# EAGLE design Y-babies ATtiny84 v04 (EAGLE 6.5.0)
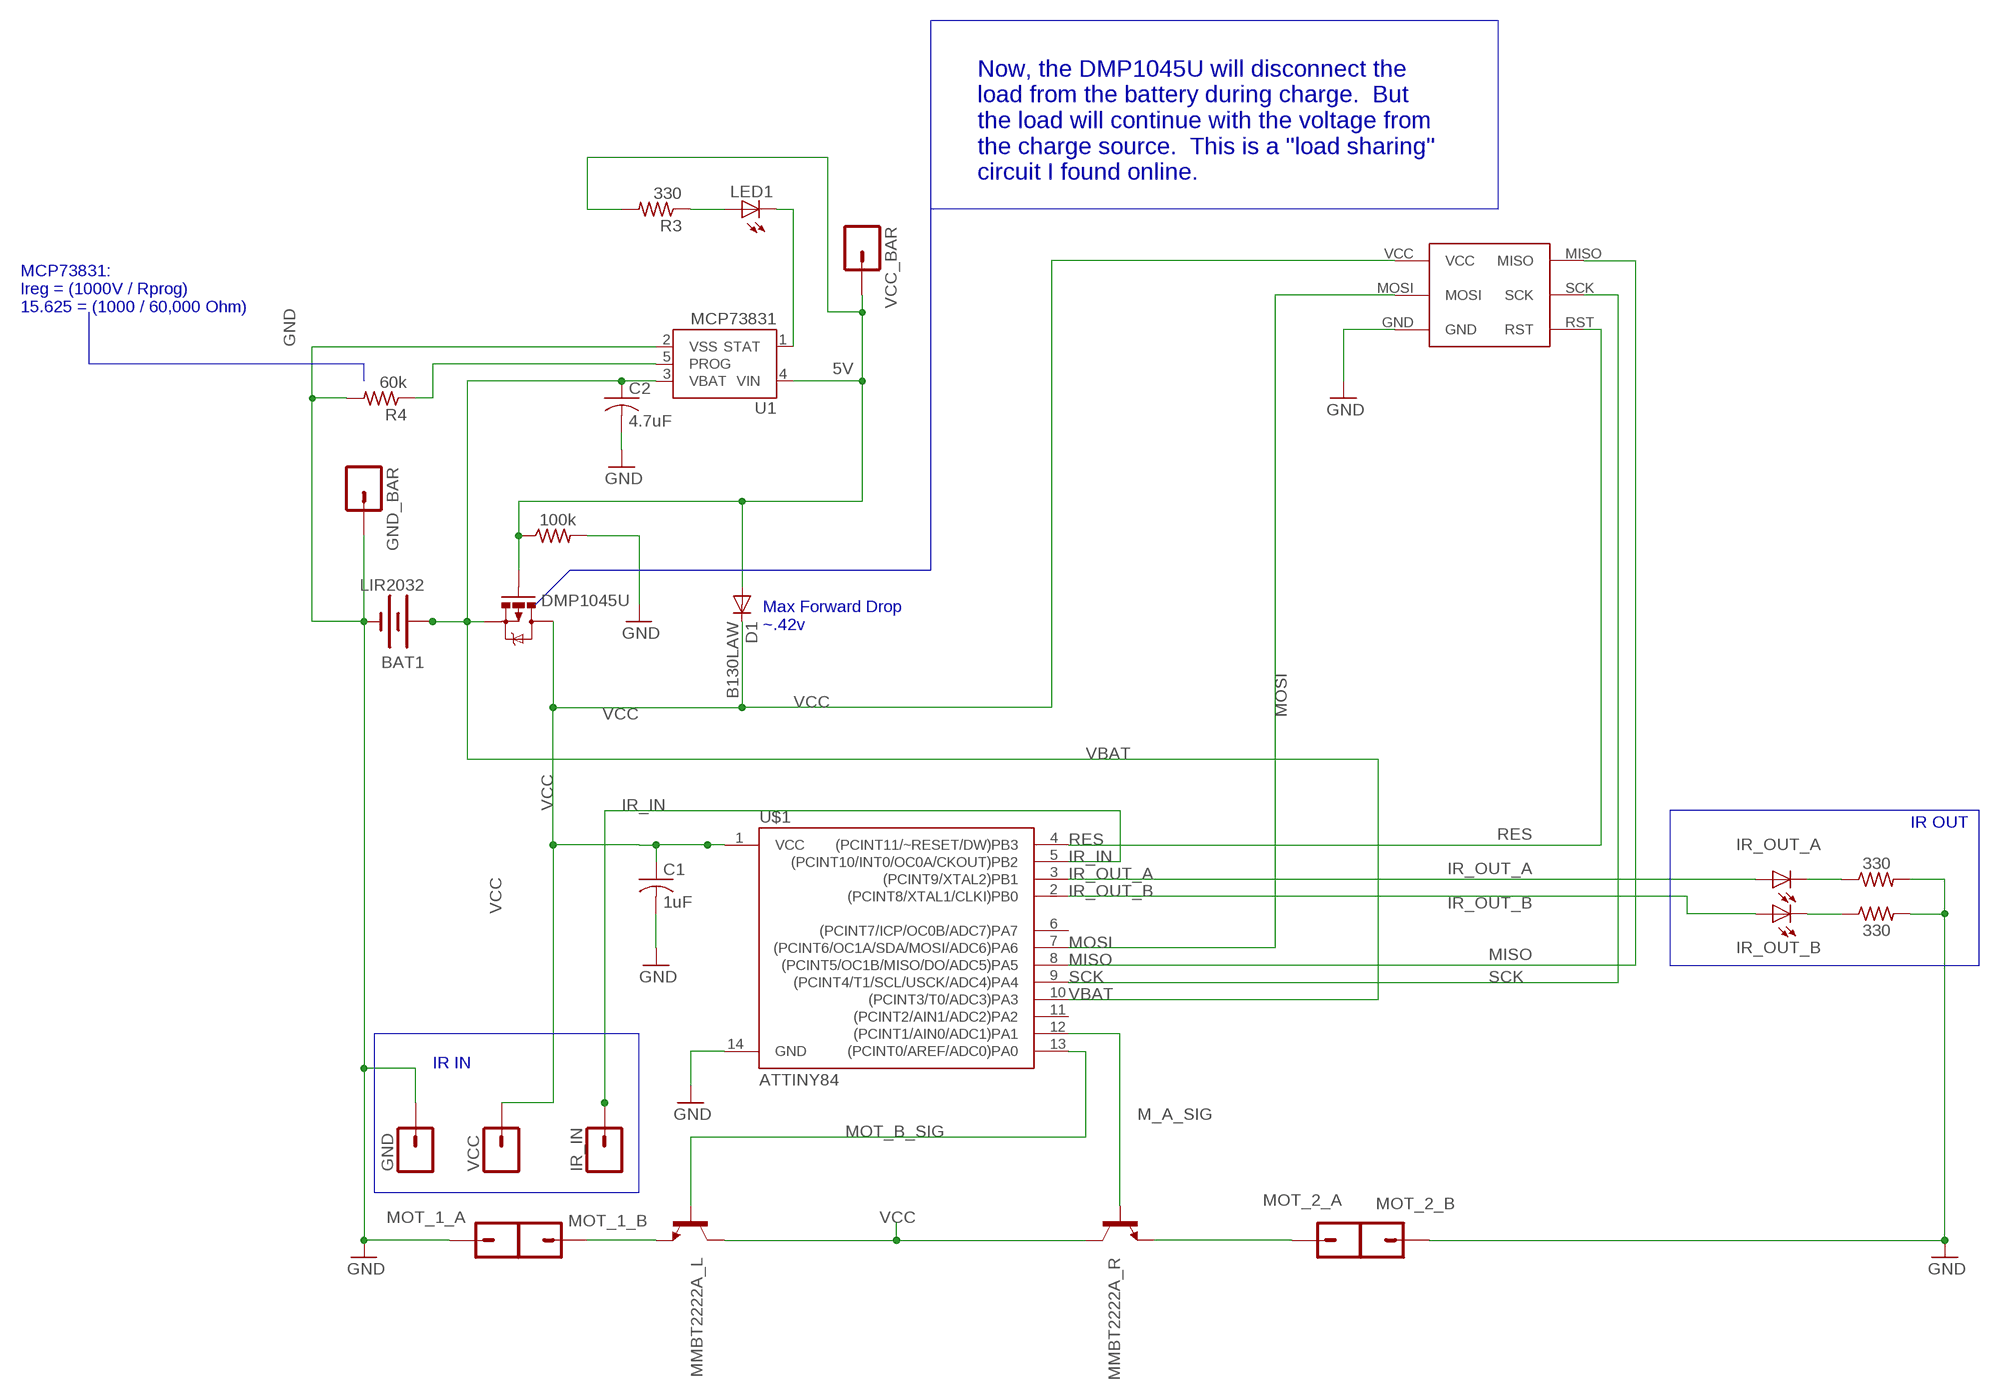
[diagram p0: schematic, sheet 1]

## Parts
BAT1  LIR2032  BATTERY20PTH  [BATTCOM_20MM_PTH]
C1  1uF  C-USC0402K  [C0402K]
C2  4.7uF  C-USC0805K  [C0805K]
D1  B130LAW  DIODE-SOD123  [SOD123]
DMP1045U  MOSFET-PCHANNELSMD  [SOT23-3]
GND  M01PTH  [1X01]
GND_BAR  M01PTH  [1X01]
IR_IN  M01PTH  [1X01]
IR_OUT_A  LED3MM  [LED3MM]
IR_OUT_B  LED3MM  [LED3MM]
LED1  LEDSML0603  [SML0603]
MMBT2222A_L  TRANSISTOR_NPNSOT23  [SOT23]
MMBT2222A_R  TRANSISTOR_NPNSOT23  [SOT23]
MOT_1_A  M01SMD-4.5X1.5  [PAD-1.5X4.5]
MOT_1_B  M01SMD-4.5X1.5  [PAD-1.5X4.5]
MOT_2_A  M01SMD-4.5X1.5  [PAD-1.5X4.5]
MOT_2_B  M01SMD-4.5X1.5  [PAD-1.5X4.5]
R1  330  R-US_R0402  [R0402]
R2  330  R-US_R0402  [R0402]
R3  330  R-US_R0402  [R0402]
R4  60k  R-US_R0402  [R0402]
R5  100k  R-US_R0402  [R0402]
U1  MCP73831  [SOT23-5]
U$1  ATTINY84  [SO14]
U$2  POGO_PIN_SPI_PAD  [POGO_PIN_SPI_PAD]
VCC  M01PTH  [1X01]
VCC_BAR  M01PTH  [1X01]

## Nets
5V: D1.A DMP1045U.1(G) R3.2 R5.1 U1.4(VIN) VCC_BAR.1
GND: BAT1.2(-) C1.2 C2.2 GND.1 GND_BAR.1 MOT_1_A.P$1 MOT_2_B.P$1 R1.2 R2.2 R4.2 R5.2 U1.2(VSS) U$1.14(GND) U$2.GND
IR_IN: IR_IN.1 U$1.5((PCINT10/INT0/OC0A/CKOUT)PB2)
IR_OUT_A: IR_OUT_A.A U$1.3((PCINT9/XTAL2)PB1)
IR_OUT_B: IR_OUT_B.A U$1.2((PCINT8/XTAL1/CLKI)PB0)
M_A_IN: MMBT2222A_R.2(E) MOT_2_A.P$1
M_A_SIG: MMBT2222A_R.1(B) U$1.12((PCINT1/AIN0/ADC1)PA1)
MISO: U$1.8((PCINT5/OC1B/MISO/DO/ADC5)PA5) U$2.MISO
MOSI: U$1.7((PCINT6/OC1A/SDA/MOSI/ADC6)PA6) U$2.MOSI
MOT_B_IN: MMBT2222A_L.2(E) MOT_1_B.P$1
MOT_B_SIG: MMBT2222A_L.1(B) U$1.13((PCINT0/AREF/ADC0)PA0)
N$1: LED1.C U1.1(STAT)
N$2: LED1.A R3.1
N$7: IR_OUT_A.K(C) R1.1
N$8: IR_OUT_B.K(C) R2.1
N$10: R4.1 U1.5(PROG)
RES: U$1.4((PCINT11/~RESET/DW)PB3) U$2.RST
SCK: U$1.9((PCINT4/T1/SCL/USCK/ADC4)PA4) U$2.SCK
VBAT: BAT1.1(+) C2.1 DMP1045U.2(S) U1.3(VBAT) U$1.10((PCINT3/T0/ADC3)PA3)
VCC: C1.1 D1.C DMP1045U.3(D) MMBT2222A_L.3(C) MMBT2222A_R.3(C) U$1.1(VCC) U$2.VCC VCC.1
Unconnected: U$1.6((PCINT7/ICP/OC0B/ADC7)PA7) U$1.11((PCINT2/AIN1/ADC2)PA2)

## Buses
B$1
B$2
B$3
B$4

## Notes on the sheet
- Now, the DMP1045U will disconnect the
  load from the battery during charge.  But
  the load will continue with the voltage from
  the charge source.  This is a "load sharing" 
  circuit I found online.
- MCP73831:
  Ireg = (1000V / Rprog)
  15.625 = (1000 / 60,000 Ohm)
- Max Forward Drop
  ~.42v
- IR OUT
- IR IN

## Library data of the parts
BAT1 = SparkFun-Electromechanical:BATTERY: Battery Holders Various common sizes : AA, AAA, 20mm coin cell and 12mm coin cell. 20MM_4LEGS, BATT-10373
C1 C2 = resistor:C-US: CAPACITOR, American symbol
D1 = diode:DIODE-: DIODE
DMP1045U = SparkFun-DiscreteSemi:MOSFET-PCHANNEL: Generic PMOSFET
GND GND_BAR IR_IN MOT_1_A MOT_1_B MOT_2_A MOT_2_B VCC VCC_BAR = SparkFun:M01: Header 1 Standard 1-pin 0.1" header. Use with straight break away headers (SKU : PRT-00116), right angle break away headers (PRT-00553), swiss pins (PRT-00743), machine pins (PRT-00117), and female headers (PRT-00115).
IR_OUT_A IR_OUT_B LED1 = led:LED: LED OSRAM: - CHIPLED LG R971, LG N971, LY N971, LG Q971, LY Q971, LO R971, LY R971 LH N974, LH R974 LS Q976, LO Q976, LY Q976 LO Q996 - Hyper CHIPLED LW Q18S LB Q993, LB Q99A, LB R99A - SideLED LS A670, LO A670, LY A670, LG A670, LP A670 LB A673, LV A673, LT A673, LW A673 LH A674 LY A675 LS A676, LA A676, LO A676, LY A676, LW A676 LS A679, LY A679, LG A679 - Hyper Micro SIDELED® LS Y876, LA Y876, LO Y876, LY Y876 LT Y87S - SmartLED LW L88C, LW L88S LB L89C, LB L89S, LG L890 LS L89K, LO L89K, LY L89K LS L896, LA L896, LO L896, LY L896 - TOPLED LS T670, LO T670, LY T670, LG T670, LP T670 LSG T670, LSP T670, LSY T670, LOP T670, LYG T670 LG T671, LOG T671, LSG T671 LB T673, LV T673, LT T673, LW T673 LH T674 LS T676, LA T676, LO T676, LY T676, LB T676, LH T676, LSB T676, LW T676 LB T67C, LV T67C, LT T67C, LS T67K, LO T67K, LY T67K, LW E67C LS E67B, LA E67B, LO E67B, LY E67B, LB E67C, LV E67C, LT E67C LW T67C LS T679, LY T679, LG T679 LS T770, LO T770, LY T770, LG T770, LP T770 LB T773, LV T773, LT T773, LW T773 LH T774 LS E675, LA E675, LY E675, LS T675 LS T776, LA T776, LO T776, LY T776, LB T776 LHGB T686 LT T68C, LB T68C - Hyper Mini TOPLED® LB M676 - Mini TOPLED Santana® LG M470 LS M47K, LO M47K, LY M47K Source: http://www.osram.convergy.de LUXEON: - LUMILED® LXK2-PW12-R00, LXK2-PW12-S00, LXK2-PW14-U00, LXK2-PW14-V00 LXK2-PM12-R00, LXK2-PM12-S00, LXK2-PM14-U00 LXK2-PE12-Q00, LXK2-PE12-R00, LXK2-PE12-S00, LXK2-PE14-T00, LXK2-PE14-U00 LXK2-PB12-K00, LXK2-PB12-L00, LXK2-PB12-M00, LXK2-PB14-N00, LXK2-PB14-P00, LXK2-PB14-Q00 LXK2-PR12-L00, LXK2-PR12-M00, LXK2-PR14-Q00, LXK2-PR14-R00 LXK2-PD12-Q00, LXK2-PD12-R00, LXK2-PD12-S00 LXK2-PH12-R00, LXK2-PH12-S00 LXK2-PL12-P00, LXK2-PL12-Q00, LXK2-PL12-R00 Source: www.luxeon.com KINGBRIGHT: KA-3528ASYC Source: www.kingbright.com
MMBT2222A_L MMBT2222A_R = SparkFun:TRANSISTOR_NPN: Transistor NPN BJT configuration in SOT23 package. MMBT2222 is the common NPN we use. Double check BCE configuration again layout.
R1-R5 = resistor:R-US_: RESISTOR, American symbol
U1 = SparkFun-PowerIC:MCP73831: Miniature single cell, fully integrated Li-Ion, Li-polymer charge management controller http://ww1.microchip.com/downloads/en/DeviceDoc/21984a.pdf IC-09995; PROD_ID: IC-09995
U$1 = SparkFun-DigitalIC:ATTINY84: Atmel 14-pin 2/4/8kB flash uC
U$2 = Random parts:POGO_PIN_SPI_PAD

## Board
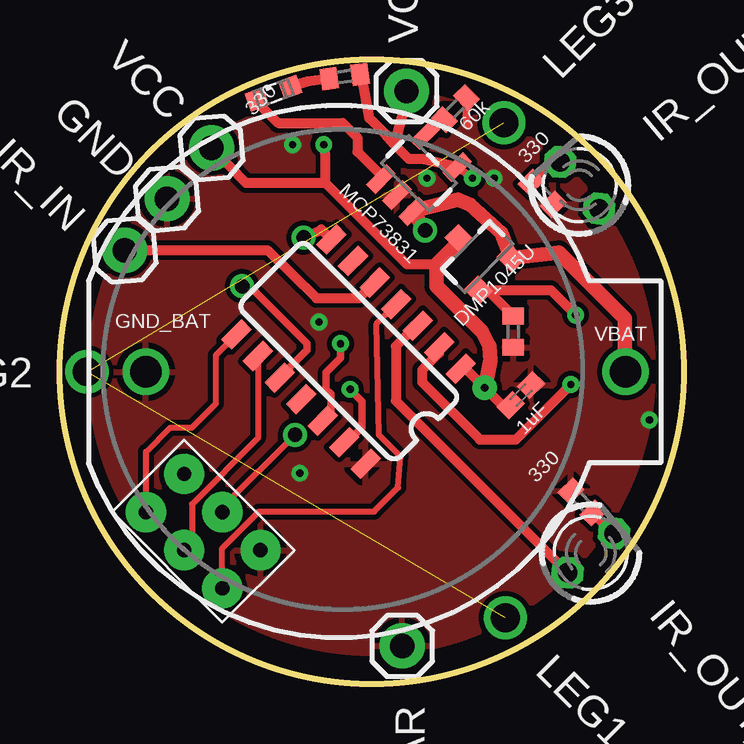
[diagram p1: board, top side]
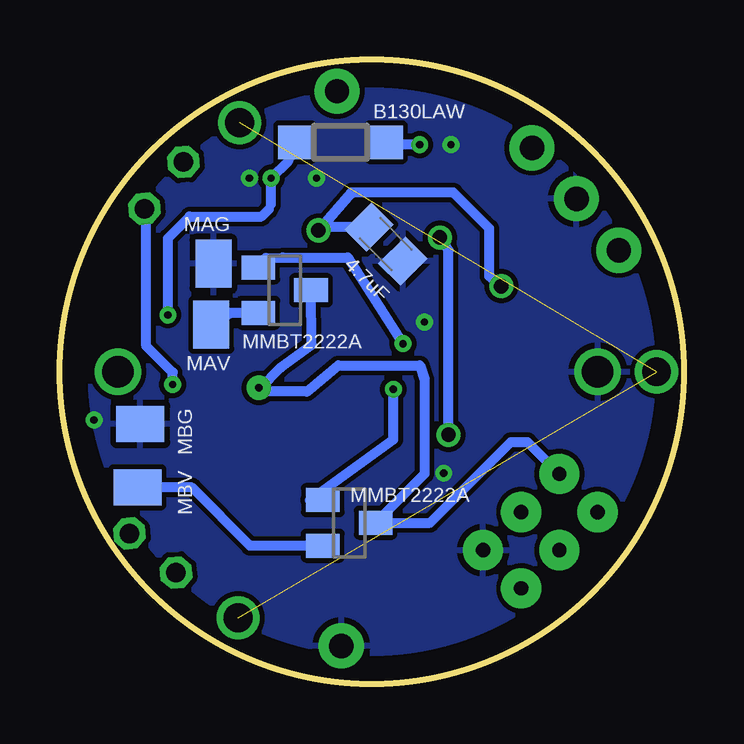
[diagram p2: board, bottom side, seen from below]

Size 26 x 26 mm. Coordinates in mm from the lower left corner, seen from the top.
Outline: circle at 13,13 radius 13
Copper layers (1*16): Top 0.035mm / dielectric 1.5mm / Bottom 0.035mm
Design rules "default": minimum track width 10mil, minimum drill 24mil, track to track 8mil, track to pad 8mil, pad to pad 8mil, via to via 8mil, smd to smd 8mil, copper to edge 40mil, drill to drill 8mil, minimum pad ring 10mil, minimum via ring 8mil, stop-mask expansion 4mil, vias tented up to drill 0mil, thermal gap 10mil

### Footprints (pad centres in the part's own frame; a part is rotated, then mirrored left to right if it is on the bottom)
BATTCOM_20MM_PTH = drill 1.3: 1 11.85,0; 2 -8.15,0
C0402K = smd 0.925 x 0.74: 1 -0.6,0; 2 0.6,0
C0805K = smd 1.3 x 1.6: 1 -1,0; 2 1,0
SOD123 = smd 1.4 x 1.4: A 1.9,0; C -1.9,0
SOT23-3 = smd 0.8 x 0.9: 1 -0.95,-1; 2 0.95,-1; 3 0,1.1
1X01 = drill 1.016 pad 1.88: 1 0,0
LED3MM = drill 0.813 octagon: A -1.27,0; K 1.27,0
SML0603 = smd 0.8 x 0.8: A 0.75,0; C -0.75,0
SOT23 = smd 1 x 1.4: 1 -0.95,-1.1; 2 0.95,-1.1; 3 0,1.1
PAD-1.5X4.5 = smd 1.5 x 2: P$1 0,0
R0402 = smd 0.7 x 0.9: 1 -0.65,0; 2 0.65,0
SOT23-5 = smd 0.55 x 1.2: 1 -0.95,-1.3; 2 0,-1.3; 3 0.95,-1.3; 4 0.95,1.3; 5 -0.95,1.3
SO14 = smd 0.6 x 1.2: 1 -3.81,-2.8; 2 -2.54,-2.8; 3 -1.27,-2.8; 4 0,-2.8; 5 1.27,-2.8; 6 2.54,-2.8; 7 3.81,-2.8; 8 3.81,2.8; 9 2.54,2.8; 10 1.27,2.8; 11 0,2.8; 12 -1.27,2.8; 13 -2.54,2.8; 14 -3.81,2.8
POGO_PIN_SPI_PAD = drill 0.6 pad 1.676: GND 1,-1; MISO 3.25,-5.5; MOSI 1,-3.25; RST 3.25,-1; SCK 3.25,-3.25; VCC 1,-5.5

### Placement (x,y rotation side)
BAT1  11.73,13 0 top
C1  19.22,12.03 45 top
C2  12.41,18.32 315 bottom
D1  14.3,22.57 180 bottom
DMP1045U  17.42,17.78 45 top
GND  4.46,20.22 5 top
GND_BAR  14.27,1.57 0 top
IR_IN  2.7,18.06 5 top
IR_OUT_A  22.13,5.44 40 top
IR_OUT_B  21.67,20.77 130 top
LED1  8.91,24.62 20 top
MMBT2222A_L  13.94,6.7 270 bottom
MMBT2222A_R  16.63,16.4 270 bottom
MOT_1_A  22.65,10.82 270 bottom
MOT_1_B  22.77,8.18 270 bottom
MOT_2_A  19.69,14.96 0 bottom
MOT_2_B  19.6,17.51 0 bottom
R1  21.77,7.57 135 top
R2  20.11,20.44 315 top
R3  11.87,25.31 8 top
R4  16.49,23.97 45 top
R5  18.9,14.67 270 top
U1  14.97,21.28 315 top
U$1  12.04,13.84 135 top
U$2  9.77,5.56 225 top
VCC  6.32,22.33 5 top
VCC_BAR  14.45,24.7 0 top

### Tracks (layer width: path | path; a pad name or v marks a point on that pad's centre or on a via)
5V  (via drill 0.3)
  Top 0.305: 14.3,23.75 VCC_BAR.1 | v17.2,21.07 16.8,21.37 U1.4
  Top 0.406: U1.4 15.1,21.87 14.55,21.87 13.95,22.47 | 13.95,22.47 14.3,23.75 | v21.5,15.37 20.47,16.4 DMP1045U.1 17.82,16.4 R5.1 | 13.95,22.47 13.55,22.92 12.9,23.57 12.6,25.29 R3.2
  Bottom 0.305: 17.3,19.77 17.2,19.97
  Bottom 0.406: v21.5,15.37 21.5,18.57 20.6,19.47 17.6,19.47 17.3,19.77 | 17.2,19.97 v17.2,21.07 16.5,21.77 D1.A
GND  (via drill 0.3)
  Top 0.305: R4.2 16.95,23.32 17,23.27
  other vias: 24.58,10.99 10,8.77 18.1,21.07 15.3,21.07 9.7,22.47 10.8,15.07
  pour Top: -0.97,-0.97 26.97,-0.97 26.97,26.97 -0.97,26.97
  pour Bottom: -0.97,-0.97 26.97,-0.97 26.97,26.97 -0.97,26.97
IR_IN
  Top 0.406: IR_IN.1 8.65,18.06 10.69,16.07 12.47,16.07 U$1.5
IR_OUT_A
  Top 0.305: U$1.3 14.85,14.92
  Top 0.406: 14.85,14.92 14,14.07 14,11.79 IR_OUT_A.A
IR_OUT_B  (via drill 0.3)
  Top 0.305: U$1.2 15.81,13.78
  Top 0.406: 15.81,13.78 15.1,13.07 15.1,12.57 17.5,10.17 19,10.17 v21.3,12.47
  Bottom 0.406: v21.3,12.47 21.3,12.97 22.4,14.07 22.4,19.72 IR_OUT_B.A
LEG2  (via drill 1.2)  (2 unrouted)
  other vias: 1.13,13 18.52,23.38 18.57,2.74
M_A_IN
  Bottom 0.406: MMBT2222A_R.2 18.88,15.45 MOT_2_A.P$1
M_A_SIG  (via drill 0.3)
  Top 0.305: v11.7,14.17 11.7,13.57 11.1,12.97 11.1,12.27 11.3,12.07 11.3,11.31 U$1.12
  Bottom 0.406: MMBT2222A_R.1 17.42,17.75 16.7,17.77 14,17.77 v11.7,14.17
MISO
  Top 0.254: U$2.MISO 3.59,9.66 4.6,10.67 5.5,10.67 6.5,11.67 6.5,13.69 U$1.8
MOSI  (via drill 0.6)
  Top 0.254: U$2.MOSI 6.77,7.34 v9.8,10.37
  Top 0.406: v10.16,18.6 10.9,18.93 U$1.7
  Bottom 0.406: v9.8,10.37 9.8,18.07 v10.16,18.6
MOT_B_IN
  Bottom 0.305: MOT_1_B.P$1
  Bottom 0.406: MMBT2222A_L.2 18.08,5.75 20.5,8.17 MOT_1_B.P$1
MOT_B_SIG  (via drill 0.3)
  Top 0.305: U$1.13 11.99,10.06 12.6,10.67 12.6,11.77 v12.1,12.27
  Bottom 0.305: MMBT2222A_L.1 15.58,7.65
  Bottom 0.406: 15.58,7.65 12.1,10.17 v12.1,12.27
N$1
  Top 0.305: U1.1 13.38,21.19
  Top 0.406: 13.38,21.19 12.4,22.17 12.4,22.77 11.8,23.37 9.1,23.37 8.41,24.06 LED1.C
N$2
  Top 0.406: R3.1 10.32,25.1 LED1.A
N$7
  Top 0.406: IR_OUT_A.K 23.08,6.26 R1.1
N$8
  Top 0.305: IR_OUT_B.K 20.49,21.75 R2.1
N$10
  Top 0.305: U1.5 15.39,22.87 R4.1
RES
  Top 0.254: U$2.RST 6.77,5.64 8.3,7.17 13.1,7.17 14.1,8.17 14.2,9.47 13.3,10.37 13.2,15.01 U$1.4
SCK
  Top 0.254: U$1.9 8.26,10.23 5.5,7.47 5.5,5.88 U$2.SCK
VBAT  (via drill 0.6)
  Top 0.305: U$1.10 10.3,13.9 10.3,14.17 7.9,16.57 v7.6,16.57
  Top 0.61: BAT1.1 23.54,13 23.54,15.23 20.8,17.97 DMP1045U.2 18.4,18.77 17.1,19.97 16.6,20.17 U1.3 v15.22,18.89
  Bottom 0.406: v7.6,16.57 8.1,16.97 8.1,18.97 9.6,20.47 13.85,20.47 v15.22,18.89 15.09,19.03 C2.1
VCC  (via drill 0.3 pad 0.3, 0.3 pad 1.02)
  Top 0.305: U$1.1 16.74,13.13
  Top 0.406: 15.7,17.47 14.47,17.47 11.07,20.87 | 11.07,20.87 7.76,20.87 VCC.1 | 11.07,20.87 11.07,22.04 v11,22.47 | C1.1 18.44,11.6 v17.71,12.33 16.91,13.13 U$1.1
  Top 0.61: DMP1045U.3 16.64,18.41 15.7,17.47 15.7,16.57 17.6,14.67 17.9,14.07 17.95,13.47 v17.71,12.33
  Bottom 0.406: MMBT2222A_R.3 15.51,14.12 16.8,13.17 17.64,12.33 v17.71,12.33 17.55,12.17 15.7,12.17 14.4,13.27 11,13.27 10.8,12.67 10.8,8.74 MMBT2222A_L.3 10.57,6.7 7.2,10.07 6.51,10.07 U$2.VCC | v11,22.47 12.6,22.47 D1.C

### Text on the board
_tsilk: LEG3 | 60k | 330 | 330 | DMP1045U | MCP73831 | GND_BAT | VBAT | LEG2 | 1uF | 330 | LEG1
_bsilk: B130LAW | MAG | 4.7uF | MMBT2222A | MAV | MBG | MBV | MMBT2222A